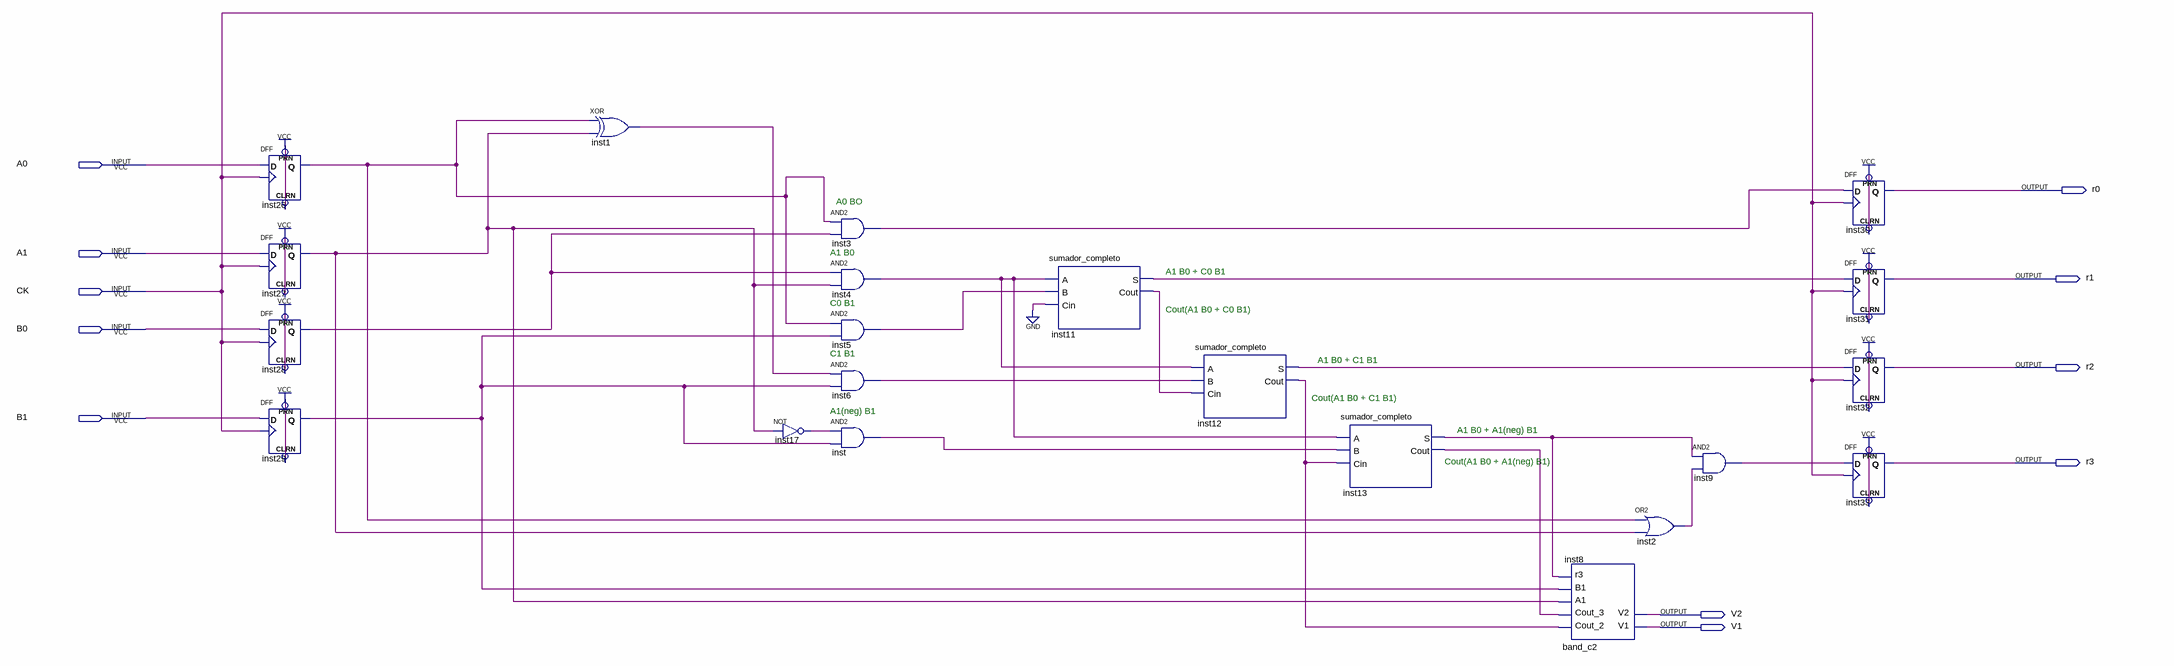
[diagram p0: schematic sheet]
// Quartus schematic multi_2b_cs.bdf as structural Verilog: 21 symbols, 11 pins
module multi_2b_cs (
  input  A0,
  input  A1,
  input  CK,
  input  B0,
  input  B1,
  output r0,
  output r1,
  output r2,
  output r3,
  output V2,
  output V1
);

  wire inst1_out, inst2_out, inst3_out, inst4_out, inst5_out, inst6_out, inst9_out, inst11_cout, inst11_s,
       inst12_cout, inst12_s, inst13_cout, inst13_s, inst17_out, inst26_q, inst27_q, inst28_q, inst29_q,
       inst_out;

  DFF inst26 (.CLRN(1'b1), .CLK(CK), .D(A0), .PRN(1'b1), .Q(inst26_q));
  DFF inst27 (.CLRN(1'b1), .CLK(CK), .D(A1), .PRN(1'b1), .Q(inst27_q));
  DFF inst28 (.CLRN(1'b1), .CLK(CK), .D(B0), .PRN(1'b1), .Q(inst28_q));
  DFF inst29 (.CLRN(1'b1), .CLK(CK), .D(B1), .PRN(1'b1), .Q(inst29_q));
  xor inst1 (inst1_out, inst26_q, inst27_q);
  not inst17 (inst17_out, inst27_q);
  and inst3 (inst3_out, inst26_q, inst28_q);
  and inst4 (inst4_out, inst28_q, inst27_q);
  and inst5 (inst5_out, inst26_q, inst29_q);
  and inst6 (inst6_out, inst1_out, inst29_q);
  and inst (inst_out, inst17_out, inst29_q);
  sumador_completo inst11 (.A(inst4_out), .B(inst5_out), .Cin(1'b0), .S(inst11_s), .Cout(inst11_cout));
  sumador_completo inst12 (.A(inst4_out), .B(inst6_out), .Cin(inst11_cout), .S(inst12_s), .Cout(inst12_cout));
  sumador_completo inst13 (.A(inst4_out), .B(inst_out), .Cin(inst12_cout), .S(inst13_s), .Cout(inst13_cout));
  band_c2 inst8 (
    .Cout_2(inst12_cout), .Cout_3(inst13_cout), .A1(inst27_q), .B1(inst29_q), .r3(inst13_s), .V1(V1), .V2(V2));
  or inst2 (inst2_out, inst26_q, inst27_q);
  and inst9 (inst9_out, inst13_s, inst2_out);
  DFF inst30 (.CLRN(1'b1), .CLK(CK), .D(inst3_out), .PRN(1'b1), .Q(r0));
  DFF inst31 (.CLRN(1'b1), .CLK(CK), .D(inst11_s), .PRN(1'b1), .Q(r1));
  DFF inst32 (.CLRN(1'b1), .CLK(CK), .D(inst12_s), .PRN(1'b1), .Q(r2));
  DFF inst33 (.CLRN(1'b1), .CLK(CK), .D(inst9_out), .PRN(1'b1), .Q(r3));

  // Notes on the sheet:
  //   A0 BO
  //   A1 B0
  //   A1 B0 + C0 B1
  //   C0 B1
  //   Cout(A1 B0 + C0 B1)
  //   C1 B1
  //   A1 B0 + C1 B1
  //   Cout(A1 B0 + C1 B1)
  //   A1(neg) B1
  //   A1 B0 + A1(neg) B1
  //   Cout(A1 B0 + A1(neg) B1)
endmodule
